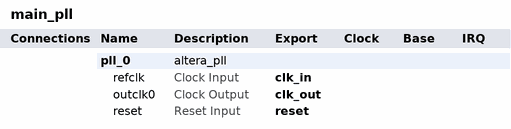
[diagram p0: system contents]
# Platform Designer (Qsys) system main_pll, Cyclone V 5CSEMA5F31C6
# Parameters at their usual value, and those the tool derives, are not listed.
package require -exact qsys 14.1
create_system main_pll
set_project_property DEVICE_FAMILY {Cyclone V}
set_project_property DEVICE 5CSEMA5F31C6

add_instance pll_0 altera_pll 14.1
set_instance_parameter_value pll_0 gui_actual_output_clock_frequency0 {193.333333 MHz}
set_instance_parameter_value pll_0 gui_device_speed_grade 1
set_instance_parameter_value pll_0 gui_number_of_clocks 1
set_instance_parameter_value pll_0 gui_operation_mode direct
set_instance_parameter_value pll_0 gui_output_clock_frequency0 25.175
set_instance_parameter_value pll_0 gui_pll_mode {Fractional-N PLL}
set_instance_parameter_value pll_0 gui_reference_clock_frequency 50.0
set_instance_parameter_value pll_0 gui_use_locked false

# exported interfaces
add_interface clk_in clock sink
set_interface_property clk_in EXPORT_OF pll_0.refclk
add_interface clk_out clock source
set_interface_property clk_out EXPORT_OF pll_0.outclk0
add_interface reset reset sink
set_interface_property reset EXPORT_OF pll_0.reset

set_interconnect_requirement {$system} qsys_mm.clockCrossingAdapter HANDSHAKE
set_interconnect_requirement {$system} qsys_mm.insertDefaultSlave FALSE
set_interconnect_requirement {$system} qsys_mm.maxAdditionalLatency 1

save_system main_pll.qsys
